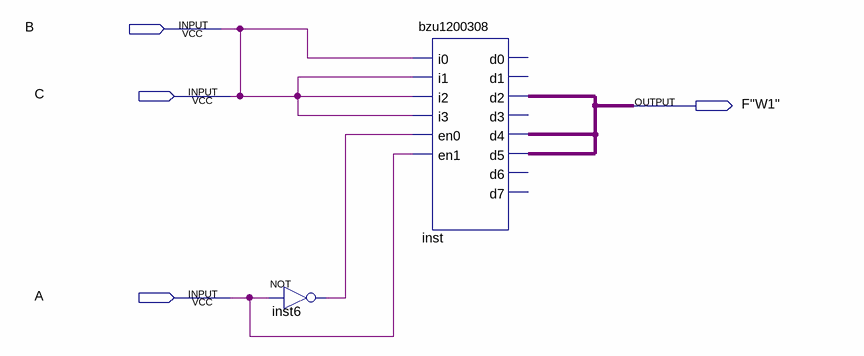
[diagram p0: schematic sheet]
// Quartus schematic secondda.bdf as structural Verilog: 2 symbols, 4 pins
module secondda (
  input  B,
  input  C,
  input  A,
  output \F"W1" 
);

  wire inst6_out;

  not inst6 (inst6_out, A);
  bzu1200308 inst (
    .i0(B), .i1(B), .i2(B), .i3(B), .en0(inst6_out), .en1(A), .d2(\F"W1" ), .d4(\F"W1" ), .d5(\F"W1" ));  // open: d0, d1, d3, d6, d7

  assign C = B;
endmodule
